# EAGLE schematic Fan-and-temperature-controller (EAGLE 9.5.2)
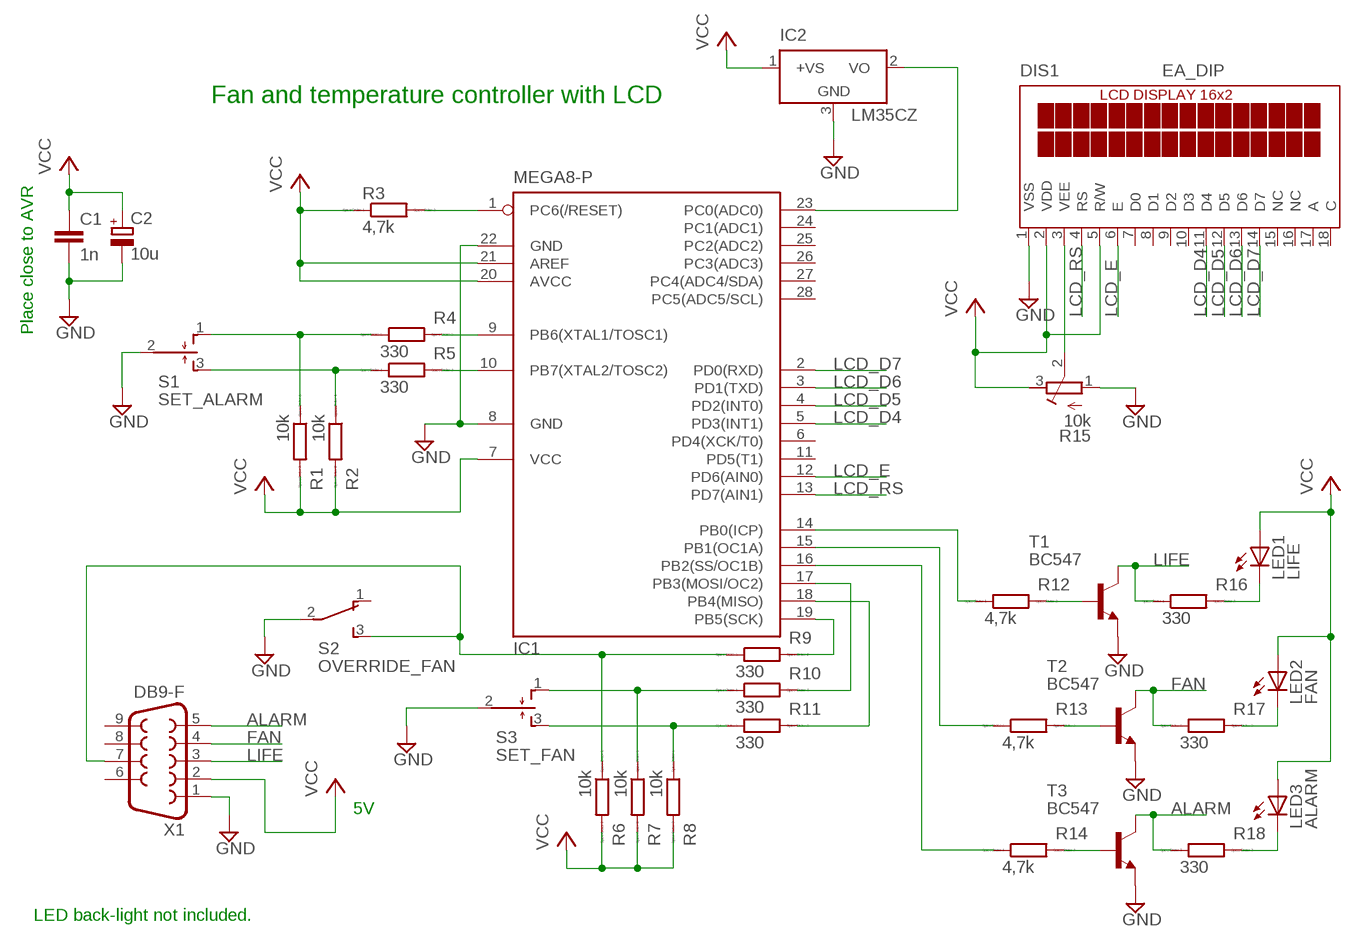
[diagram p0: schematic, sheet 1]

## Parts
C1  1n  C-EU025-024X044  [C025-024X044]
C2  10u  CPOL-EUE1.8-4  [E1,8-4]
DIS1  EA_DIP  [EA_DIP]
IC1  MEGA8-P  [DIL28-3]
IC2  LM35CZ  [TO92]
LED1  LIFE  LED5MM  [LED5MM]
LED2  FAN  LED5MM  [LED5MM]
LED3  ALARM  LED5MM  [LED5MM]
R1  10k  R0204/7  [0204/7]
R2  10k  R0204/7  [0204/7]
R3  4,7k  R0204/7  [0204/7]
R4  330  R0204/7  [0204/7]
R5  330  R0204/7  [0204/7]
R6  10k  R0204/7  [0204/7]
R7  10k  R0204/7  [0204/7]
R8  10k  R0204/7  [0204/7]
R9  330  R0204/7  [0204/7]
R10  330  R0204/7  [0204/7]
R11  330  R0204/7  [0204/7]
R12  4,7k  R0204/7  [0204/7]
R13  4,7k  R0204/7  [0204/7]
R14  4,7k  R0204/7  [0204/7]
R15  10k  R-TRIMM3339P  [RTRIM3339P]
R16  330  R0204/7  [0204/7]
R17  330  R0204/7  [0204/7]
R18  330  R0204/7  [0204/7]
S1  SET_ALARM  TL37PO  [TL3XPO]
S2  OVERRIDE_FAN  TL36PO  [TL3XPO]
S3  SET_FAN  TL37PO  [TL3XPO]
T1  BC547  [TO92]
T2  BC547  [TO92]
T3  BC547  [TO92]
X1  DB9-F  F09D  [F09D]

## Nets
ALARM: R18.1 T3.3(C) X1.5
FAN: R17.1 T2.3(C) X1.4
GND: C1.2 C2.- DIS1.1(VSS) IC1.8(GND) IC1.22(GND) IC2.3(GND) R15.1(A) S1.2(P) S2.2(P) S3.2(P) T1.1(E) T2.1(E) T3.1(E) X1.1
LCD_D4: DIS1.11(D4) IC1.5(PD3(INT1))
LCD_D5: DIS1.12(D5) IC1.4(PD2(INT0))
LCD_D6: DIS1.13(D6) IC1.3(PD1(TXD))
LCD_D7: DIS1.14(D7) IC1.2(PD0(RXD))
LCD_E: DIS1.6(E) IC1.12(PD6(AIN0))
LCD_RS: DIS1.4(RS) IC1.13(PD7(AIN1))
LIFE: R16.1 T1.3(C) X1.3
N$1: IC1.1(PC6(/RESET)) R3.2
N$2: IC1.14(PB0(ICP)) R12.1
N$3: R12.2 T1.2(B)
N$4: R13.2 T2.2(B)
N$5: R14.2 T3.2(B)
N$6: R7.1 R10.1 S3.1(O)
N$7: R8.1 R11.1 S3.3(S)
N$8: DIS1.3(VEE) R15.2(S)
N$9: IC1.9(PB6(XTAL1/TOSC1)) R4.2
N$10: IC1.10(PB7(XTAL2/TOSC2)) R5.2
N$11: R2.1 R5.1 S1.3(S)
N$12: R1.1 R4.1 S1.1(O)
N$13: IC1.23(PC0(ADC0)) IC2.2(VO)
N$14: R6.1 R9.1 S2.3(S) X1.7
N$15: IC1.19(PB5(SCK)) R9.2
N$16: IC1.15(PB1(OC1A)) R13.1
N$17: IC1.17(PB3(MOSI/OC2)) R10.2
N$18: IC1.18(PB4(MISO)) R11.2
N$19: IC1.16(PB2(SS/OC1B)) R14.1
N$20: LED1.K(C) R16.2
N$21: LED2.K(C) R17.2
N$22: LED3.K(C) R18.2
VCC: C1.1 C2.+ DIS1.2(VDD) DIS1.5(R/W) IC1.7(VCC) IC1.20(AVCC) IC1.21(AREF) IC2.1(+VS) LED1.A LED2.A LED3.A R1.2 R2.2 R3.1 R6.2 R7.2 R8.2 R15.3(E) X1.2
Unconnected: DIS1.7(D0) DIS1.8(D1) DIS1.9(D2) DIS1.10(D3) DIS1.15(NC) DIS1.16(NC) DIS1.17(A) DIS1.18(C) IC1.6(PD4(XCK/T0)) IC1.11(PD5(T1)) IC1.24(PC1(ADC1)) IC1.25(PC2(ADC2)) IC1.26(PC3(ADC3)) IC1.27(PC4(ADC4/SDA)) IC1.28(PC5(ADC5/SCL)) S2.1(O) X1.6 X1.8 X1.9

## Notes on the sheet
- Fan and temperature controller with LCD
- Place close to AVR
- 5V
- LED back-light not included.

## Library data of the parts
C1 = rcl:C-EU: CAPACITOR, European symbol
C2 = rcl:CPOL-EU: POLARIZED CAPACITOR, European symbol
DIS1 = display-lcd:EA_DIP: LCD-MODUL 2x16 - 6,68mm, INKL. KONTROLLER HD44780 Source: Data sheet <http://www.lcd-module.de/pdf/doma/dip162-d.pdf>
IC1 = atmel:MEGA8-P: MICROCONTROLLER 8 Kbytes FLASH, 1 kbytes SRAM, 512 bytes EEPROM, USART, 4-channel 10 bit ADC, 2-channel 8 bit ADC Pin compatible with Atmega48, ATMega88, ATMega168 Source: avr.lbr; OC_FARNELL: unknown; OC_NEWARK: unknown
IC2 = lm35:LM35: Single-Supply Centigrade Temperature Sensor Vout = (10mV/°C x Temp °C) +5mmmV Source: http://www.national.com/ds/LM/LM35.pdf
LED1-LED3 = led:LED: LED OSRAM: - CHIPLED LG R971, LG N971, LY N971, LG Q971, LY Q971, LO R971, LY R971 LH N974, LH R974 LS Q976, LO Q976, LY Q976 LO Q996 - Hyper CHIPLED LW Q18S LB Q993, LB Q99A, LB R99A - SideLED LS A670, LO A670, LY A670, LG A670, LP A670 LB A673, LV A673, LT A673, LW A673 LH A674 LY A675 LS A676, LA A676, LO A676, LY A676, LW A676 LS A679, LY A679, LG A679 - Hyper Micro SIDELED® LS Y876, LA Y876, LO Y876, LY Y876 LT Y87S - SmartLED LW L88C, LW L88S LB L89C, LB L89S, LG L890 LS L89K, LO L89K, LY L89K LS L896, LA L896, LO L896, LY L896 - TOPLED LS T670, LO T670, LY T670, LG T670, LP T670 LSG T670, LSP T670, LSY T670, LOP T670, LYG T670 LG T671, LOG T671, LSG T671 LB T673, LV T673, LT T673, LW T673 LH T674 LS T676, LA T676, LO T676, LY T676, LB T676, LH T676, LSB T676, LW T676 LB T67C, LV T67C, LT T67C, LS T67K, LO T67K, LY T67K, LW E67C LS E67B, LA E67B, LO E67B, LY E67B, LB E67C, LV E67C, LT E67C LW T67C LS T679, LY T679, LG T679 LS T770, LO T770, LY T770, LG T770, LP T770 LB T773, LV T773, LT T773, LW T773 LH T774 LS E675, LA E675, LY E675, LS T675 LS T776, LA T776, LO T776, LY T776, LB T776 LHGB T686 LT T68C, LB T68C - Hyper Mini TOPLED® LB M676 - Mini TOPLED Santana® LG M470 LS M47K, LO M47K, LY M47K Source: http://www.osram.convergy.de LUXEON: - LUMILED® LXK2-PW12-R00, LXK2-PW12-S00, LXK2-PW14-U00, LXK2-PW14-V00 LXK2-PM12-R00, LXK2-PM12-S00, LXK2-PM14-U00 LXK2-PE12-Q00, LXK2-PE12-R00, LXK2-PE12-S00, LXK2-PE14-T00, LXK2-PE14-U00 LXK2-PB12-K00, LXK2-PB12-L00, LXK2-PB12-M00, LXK2-PB14-N00, LXK2-PB14-P00, LXK2-PB14-Q00 LXK2-PR12-L00, LXK2-PR12-M00, LXK2-PR14-Q00, LXK2-PR14-R00 LXK2-PD12-Q00, LXK2-PD12-R00, LXK2-PD12-S00 LXK2-PH12-R00, LXK2-PH12-S00 LXK2-PL12-P00, LXK2-PL12-Q00, LXK2-PL12-R00 Source: www.luxeon.com KINGBRIGHT: KA-3528ASYC Source: www.kingbright.com
R1-R14 R16-R18 = eagle-ltspice:R: RESISTOR, European symbol; SPICEMODEL: NONE; SPICEPREFIX: R
R15 = rcl:R-TRIMM: Trimm resistor
S1 S3 = switch:TL37PO: TINY SWITCH MOM OFF MOM Source: http://www2.produktinfo.conrad.com/datenblaetter/700000-724999/705152-da-01-de-Subminiaturschalter_TL_36YO.pdf
S2 = switch:TL36PO: TINY SWITCH ON - ON Source: http://www2.produktinfo.conrad.com/datenblaetter/700000-724999/705152-da-01-de-Subminiaturschalter_TL_36YO.pdf
T1-T3 = transistor:BC547: NPN TRANSISTOR
X1 = con-subd:F09: SUB-D; OC_FARNELL: unknown; OC_NEWARK: unknown